# EAGLE design connector_boards (EAGLE 9.1.3)
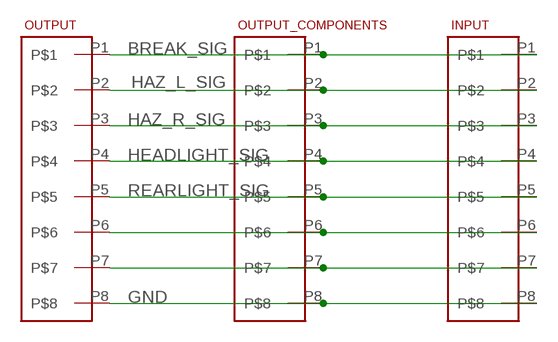
[diagram p0: schematic, sheet 1]

## Parts
INPUT  8-PIN-MOLEX-RA-FEMALE  [8-PIN-MOLEX]
OUTPUT  8-PIN-MOLEX-RA-FEMALE  [8-PIN-MOLEX]
OUTPUT_COMPONENTS  8-PIN-MOLEX-RA-FEMALE  [8-PIN-MOLEX]

## Nets
BREAK_SIG: INPUT.P1 OUTPUT.P1 OUTPUT_COMPONENTS.P1
GND: INPUT.P8 OUTPUT.P8 OUTPUT_COMPONENTS.P8
HAZ_L_SIG: INPUT.P2 OUTPUT.P2 OUTPUT_COMPONENTS.P2
HAZ_R_SIG: INPUT.P3 OUTPUT.P3 OUTPUT_COMPONENTS.P3
HEADLIGHT_SIG: INPUT.P4 OUTPUT.P4 OUTPUT_COMPONENTS.P4
N$6: INPUT.P6 OUTPUT.P6 OUTPUT_COMPONENTS.P6
N$7: INPUT.P7 OUTPUT.P7 OUTPUT_COMPONENTS.P7
REARLIGHT_SIG: INPUT.P5 OUTPUT.P5 OUTPUT_COMPONENTS.P5

## Library data of the parts
INPUT OUTPUT OUTPUT_COMPONENTS = master_library:8-PIN-MOLEX-RA-FEMALE

## Board
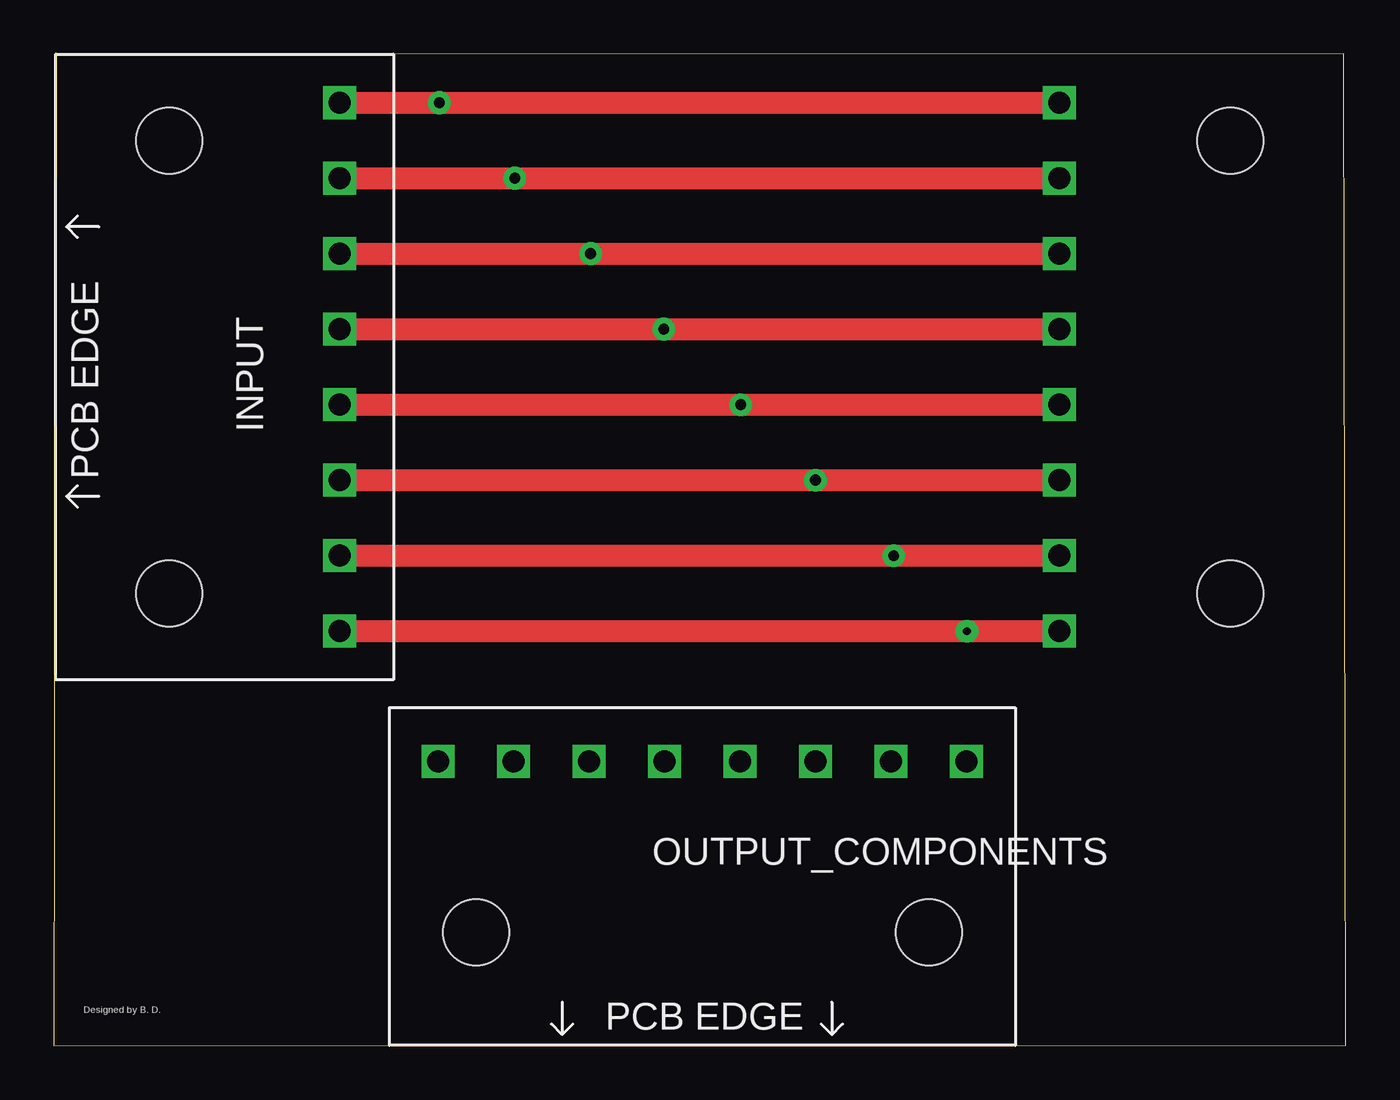
[diagram p1: board, top side]
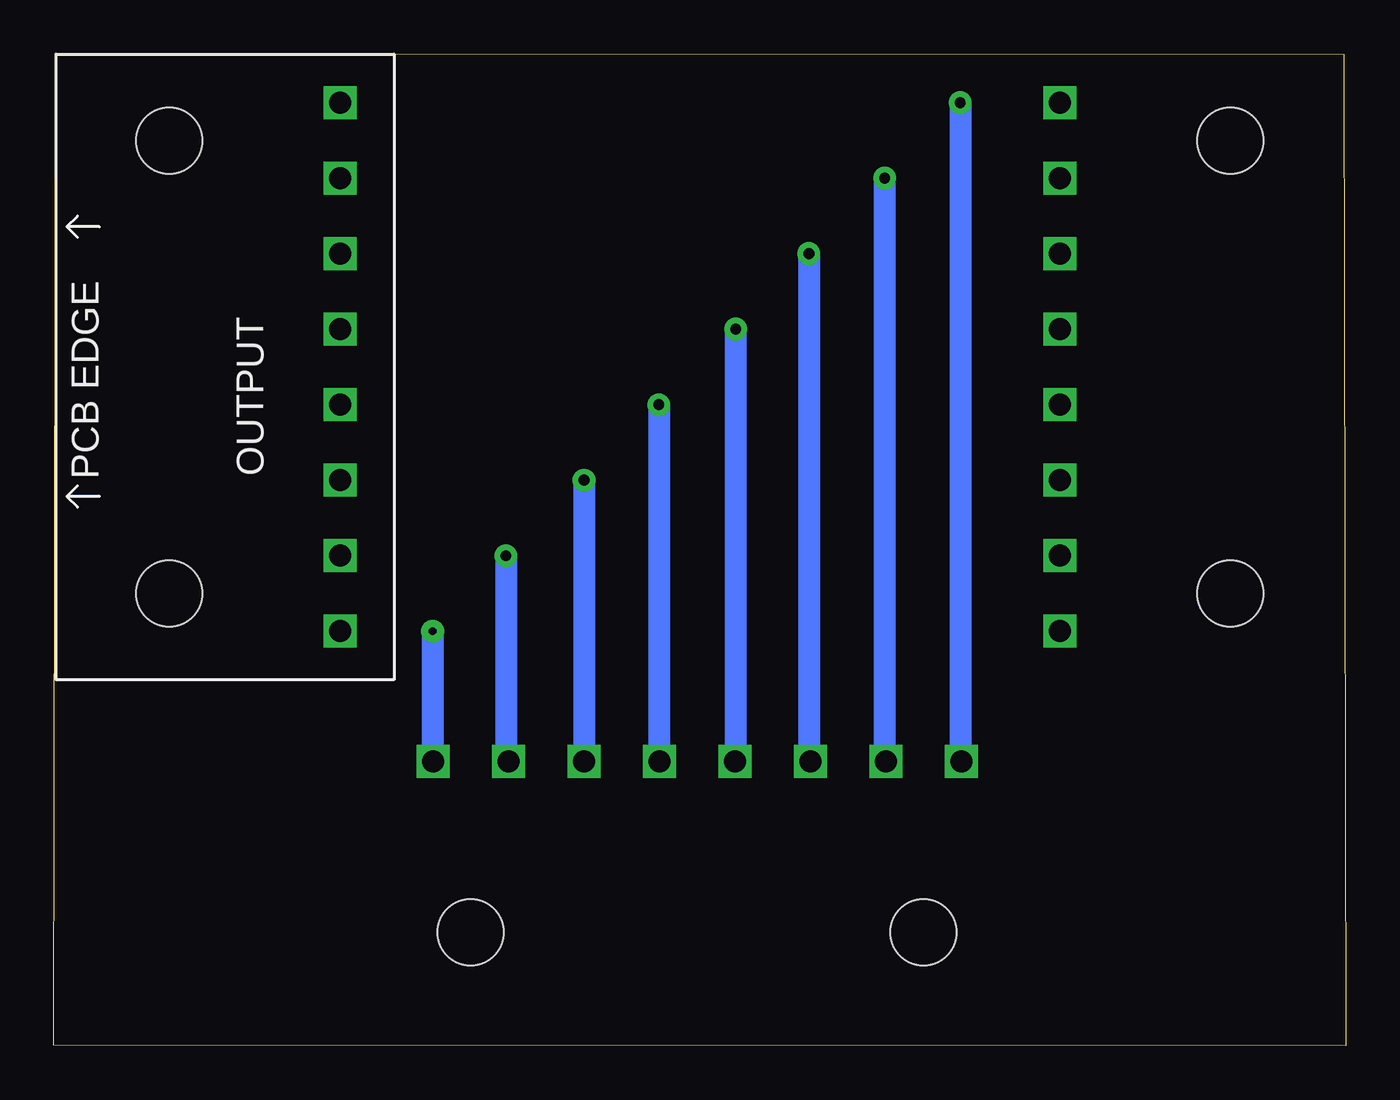
[diagram p2: board, bottom side, seen from below]

Size 59.88 x 45.99 mm. Coordinates in mm from the lower left corner, seen from the top.
Outline: 0,0 59.88,0.03 59.79,45.99 0.09,45.96 0,0
Copper layers (1*16): Top 0.035mm / dielectric 1.5mm / Bottom 0.035mm
Design rules "default": minimum track width 6mil, minimum drill 0.35mm, track to track 6mil, track to pad 6mil, pad to pad 6mil, via to via 6mil, smd to smd 6mil, copper to edge 40mil, drill to drill 6mil, minimum pad ring 10mil, minimum via ring 8mil, stop-mask expansion 4mil, vias tented up to drill 0mil, thermal gap 10mil

### Footprints (pad centres in the part's own frame; a part is rotated, then mirrored left to right if it is on the bottom)
8-PIN-MOLEX = drill 1.02 square: P1 2.248,13.16; P2 5.748,13.16; P3 9.248,13.16; P4 12.748,13.16; P5 16.248,13.16; P6 19.748,13.16; P7 23.248,13.16; P8 26.748,13.16 | hole 3.05: 4,5.25; 25,5.25

### Placement (x,y rotation side)
INPUT  0.09,45.97 270 top
OUTPUT  59.78,45.97 270 bottom
OUTPUT_COMPONENTS  15.56,0.02 0 top

### Tracks (layer width: path | path; a pad name or v marks a point on that pad's centre or on a via)
BREAK_SIG  (via drill 0.5 pad 1.05)
  Top 1.016: OUTPUT.P1 v17.87,43.72 INPUT.P1
  Bottom 0.508: 17.87,13.24 OUTPUT_COMPONENTS.P1
  Bottom 1.016: v17.87,43.72 17.87,13.24
GND  (via drill 0.35 pad 1.05)
  Top 1.016: OUTPUT.P8 v42.32,19.22 INPUT.P8
  Bottom 0.508: 42.32,13.19 OUTPUT_COMPONENTS.P8
  Bottom 1.016: v42.32,19.22 42.32,13.19
HAZ_L_SIG  (via drill 0.5 pad 1.05)
  Top 1.016: OUTPUT.P2 v21.37,40.22 INPUT.P2
  Bottom 0.508: 21.37,13.24 OUTPUT_COMPONENTS.P2
  Bottom 1.016: v21.37,40.22 21.37,13.24
HAZ_R_SIG  (via drill 0.5 pad 1.05)
  Top 1.016: OUTPUT.P3 v24.88,36.72 INPUT.P3
  Bottom 0.508: 24.88,13.25 OUTPUT_COMPONENTS.P3
  Bottom 1.016: v24.88,36.72 24.88,13.25
HEADLIGHT_SIG  (via drill 0.5 pad 1.05)
  Top 1.016: OUTPUT.P4 v28.28,33.22 INPUT.P4
  Bottom 0.508: 28.28,13.21 OUTPUT_COMPONENTS.P4
  Bottom 1.016: v28.28,33.22 28.28,13.21
N$6  (via drill 0.5 pad 1.05)
  Top 1.016: OUTPUT.P6 v35.3,26.22 INPUT.P6
  Bottom 0.508: OUTPUT_COMPONENTS.P6
  Bottom 1.016: v35.3,26.22 OUTPUT_COMPONENTS.P6
N$7  (via drill 0.5 pad 1.05)
  Top 1.016: OUTPUT.P7 v38.93,22.72 INPUT.P7
  Bottom 0.508: 38.93,13.3 OUTPUT_COMPONENTS.P7
  Bottom 1.016: v38.93,22.72 38.93,13.3
REARLIGHT_SIG  (via drill 0.5 pad 1.05)
  Top 1.016: OUTPUT.P5 v31.84,29.72 INPUT.P5
  Bottom 0.508: 31.84,13.21 OUTPUT_COMPONENTS.P5
  Bottom 1.016: v31.84,29.72 31.84,13.21

### Text on the board
tNames: Designed by B. D.